# Altium schematic sheet StLink.SchDoc (part 1 of 2)
size A4; SheetNumber: 1; SheetTotal: 1
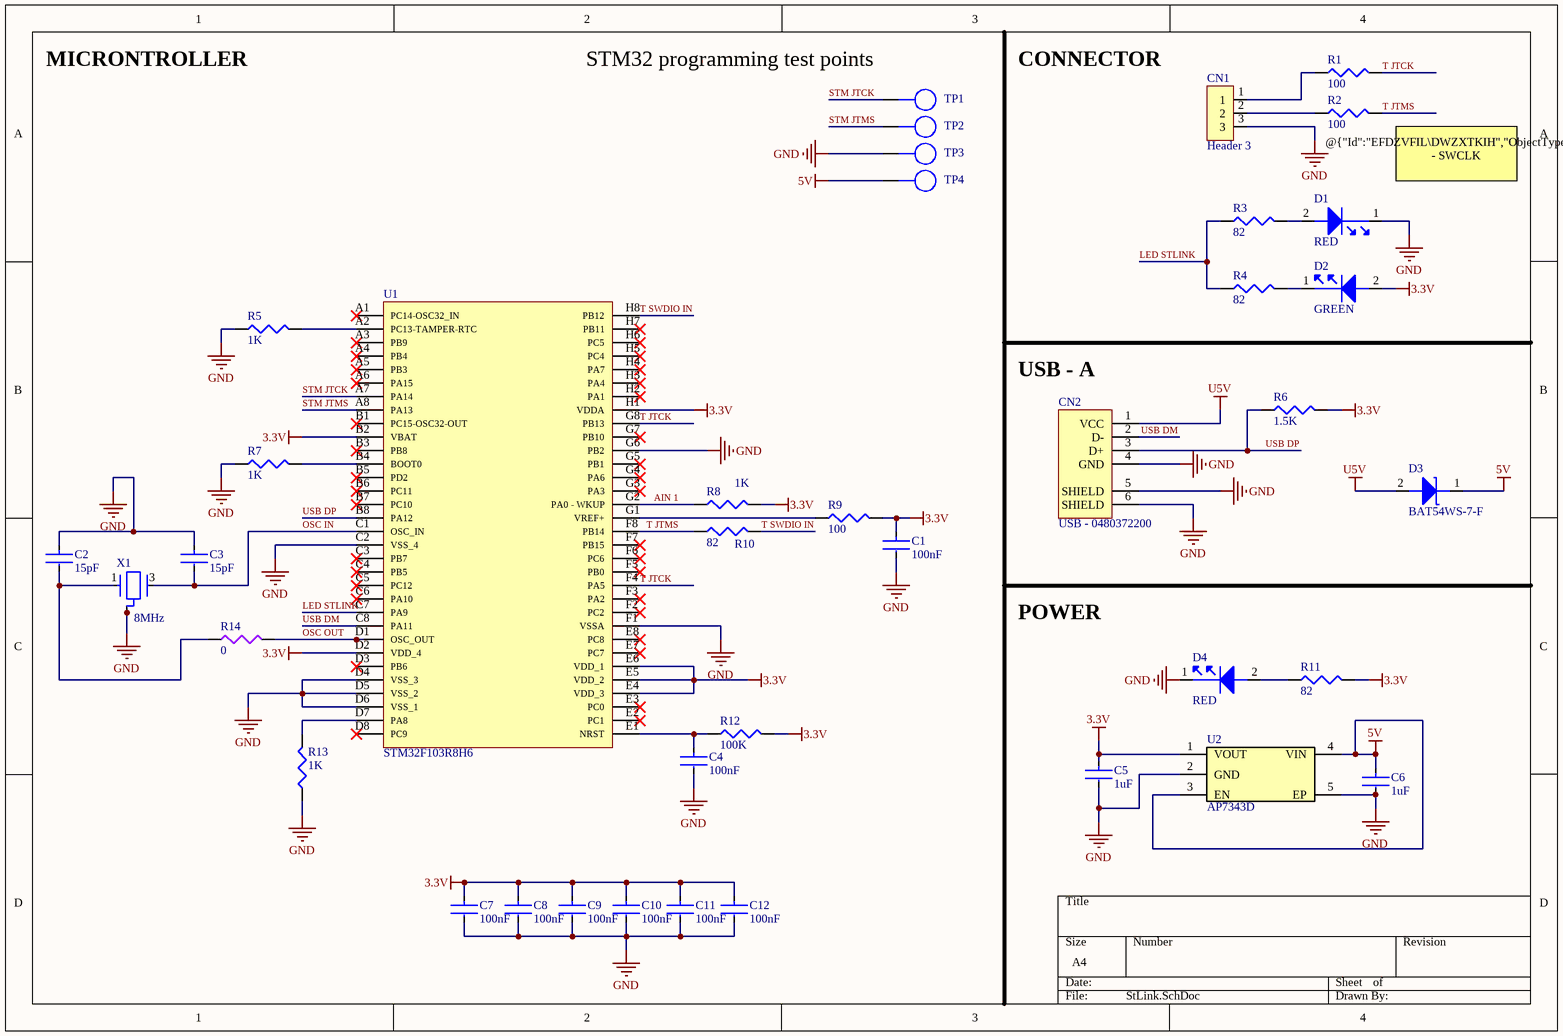
[diagram p0: StLink.SchDoc]

## Parts
C1  100nF  [C0201]
C2  15pF  [C0201]
C3  15pF  [C0201]
C4  100nF  [C0201]
C5  1uF  [C0201]
C6  1uF  [C0201]
C7  100nF  [C0201]
C8  100nF  [C0201]
C9  100nF  [C0201]
C10  100nF  [C0201]
C11  100nF  [C0201]
C12  100nF  [C0201]
CN1  Header 3  [H3x1]
CN2  USB - 0480372200  [usb A]
D1  RED  [Led 0402]
D2  GREEN  [Led 0402]
D3  BAT54WS-7-F  [SOD323]
D4  RED  [Led 0402]
R1  100  [R0201]
R2  100  [R0201]
R3  82  [R0201]
R4  82  [R0201]
R5  1K  [R0201]
R6  1.5K  [R0201]
R7  1K  [R0201]
R8  1K  [R0201]
R9  100  [R0201]
R10  82  [R0201]
R11  82  [R0201]
R12  100K  [R0201]
R13  1K  [R0201]
R14  0  [R0201]
TP1  Test_Point  [PAD]  (value not drawn)
TP2  Test_Point  [PAD]  (value not drawn)
TP3  Test_Point  [PAD]  (value not drawn)
TP4  Test_Point  [PAD]  (value not drawn)
U1  STM32F103R8H6  [Micro BGA]
U2  AP7343D  [AP7343D]
X1  8MHz  [Cristal ECS]

## Nets
3.3V: C1.1 C5.1 C7.1 C8.1 C9.1 C10.1 C11.1 C12.1 D2.2 R6.2 R8.2 R9.2 R11.2 R12.2 U1.B2(VBAT) U1.D2(VDD_4) U1.E4(VDD_3) U1.E5(VDD_2) U1.E6(VDD_1) U1.H1(VDDA) U2.1(VOUT)
5V: C6.1 D3.1 TP4.1 U2.3(EN) U2.4(VIN)
GND: C1.2 C2.1 C3.1 C4.2 C5.2 C6.2 C7.2 C8.2 C9.2 C10.2 C11.2 C12.2 CN1.3 CN2.4(GND) CN2.5(SHIELD) CN2.6(SHIELD) D1.1 D4.1 R5.1 R7.1 R13.1 TP3.1 U1.C2(VSS_4) U1.D4(VSS_3) U1.D5(VSS_2) U1.D6(VSS_1) U1.F1(VSSA) U1.G6(PB2) U2.2(GND) U2.5(EP) X1.2(GND) X1.4(GND)
U5V: CN2.1(VCC) D3.2
AIN 1: R8.1 U1.G2(PA0_-_WKUP)
LED STLINK: R3.1 R4.1 U1.C7(PA9)
OSC IN: C3.2 U1.C1(OSC_IN) X1.3
OSC OUT: R14.2 U1.D1(OSC_OUT)
STM JTCK: TP1.1 U1.A7(PA14)
STM JTMS: TP2.1 U1.A8(PA13)
T JTCK: R1.2 U1.F4(PA5) U1.G8(PB13)
T JTMS: R2.2 R10.1 U1.F8(PB14)
T SWDIO IN: R10.2 U1.H8(PB12)
USB DM: CN2.2(D-) U1.C8(PA11)
USB DP: CN2.3(D+) R6.1 U1.B8(PA12)
NetC2_2: C2.2 R14.1 X1.1
NetC4_1: C4.1 R12.1 U1.E1(NRST)
NetCN1_1: CN1.1 R1.1
NetCN1_2: CN1.2 R2.1
NetD1_2: D1.2 R3.2
NetD2_1: D2.1 R4.2
NetD4_2: D4.2 R11.1
NetR5_2: R5.2 U1.A2(PC13-TAMPER-RTC)
NetR7_2: R7.2 U1.B4(BOOT0)
NetR9_1: R9.1 U1.G1(VREF+)
NetR13_2: R13.2 U1.D7(PA8)

Not connected (* = marked no-connect by the designer): U1 A1(PC14-OSC32_IN)* A3(PB9)* A4(PB4)* A5(PB3)* A6(PA15)* B1(PC15-OSC32-OUT)* B3(PB8)* B5(PD2)* B6(PC11)* B7(PC10)* C3(PB7)* C4(PB5)* C5(PC12)* C6(PA10)* D3(PB6)* D8(PC9)* E2(PC1)* E3(PC0)* E7(PC7)* E8(PC8)* F2(PC2)* F3(PA2)* F5(PB0)* F6(PC6)* F7(PB15)* G3(PA3)* G4(PA6)* G5(PB1)* G7(PB10)* H2(PA1)* H3(PA4)* H4(PA7)* H5(PC4)* H6(PC5)* H7(PB11)*

## Notes on the sheet
- MICRONTROLLER
- (near TP1) STM32 programming test points
- CONNECTOR
- @{"Id":"EFDZVFIL\DWZXTKIH","ObjectType":1} - SWCLK
  @{"Id":"EFDZVFIL\YMTXBQSK","ObjectType":1} - SWDIO
- (near CN2) USB - A
- POWER
## Library data of the parts
C1 C4 C7-C12 = GRM033R60J104KE19D: 6.3V 100nF X5R ±10% 0201 Multilayer Ceramic Capacitors MLCC - SMD/SMT ROHS; Manufacturer: Murata; Manufacturer Lifecycle Status: IN PRODUCTION; Supplier: DigiKey; Supplier Part Number: 490-3167-6-ND; Manufacturer Part Number: GRM033R60J104KE19D; RoHS: Compliant; Category: Ceramic Capacitors; Stock: 19959733; Pricing: 1=0,1, 10=0,013, 50=0,0084, 100=0,007, 500=0,00476, 1000=0,00409, 2500=0,00338, 5000=0,00295 (USD); Value: 100nF; Case/Package: 0201; Case Code (Imperial): 0201; Case Code (Metric): 0603; Country of Origin: Philippines; Depth: 300µm; Dielectric: X5R; Dielectric Material: Ceramic; Export Control Classification Number (ECCN) Code: EAR99; Height: 300µm; Harmonized Tariff Schedule (HTS) Code: 8532.24.00.20; Introduction Date: 2004-09-04; Lead Free: Lead Free; Length: 600µm; Lifecycle Status: Production; Material: Ceramic; Max Operating Temperature: 85°C; Min Operating Temperature: -55°C; Mounting Technology: Surface Mount; Pins: 2; Number of Terminals: 2; Packaging: Cut Tape (CT); Radiation Hardening: No; REACH SVHC: Yes; Schedule B: 8532240020, 8532240020|8532240020, 8532240020|8532240020|8532240020, 8532240020|8532240020|8532240020|8532240020; Termination: SMD/SMT; Thickness: 300µm; Tolerance: 10%; Voltage: 6.3V; Voltage Rating: 6.3V; Voltage Rating (DC): 6.3V; Weight: 170.097139µg; Width: 300µm; ComponentLink1URL: https://datasheet.octopart.com:443/GRM033R60J104KE19D-Murata-datasheet-5390194.pdf?src-supplier=Upverter; ComponentLink1Description: https://datasheet.octopart.com:443/GRM033R60J104KE19D-Murata-datasheet-5390194.pdf?src-supplier=Upverter; ComponentLink2URL: https://datasheet.octopart.com:443/GRM033R60J104KE19D-Murata-datasheet-62317028.pdf?src-supplier=element14+APAC; ComponentLink2Description: https://datasheet.octopart.com:443/GRM033R60J104KE19D-Murata-datasheet-62317028.pdf?src-supplier=element14+APAC; ComponentLink3URL: https://datasheet.octopart.com:443/GRM033R60J104KE19D-Murata-datasheet-17853058.pdf?src-supplier=element14+APAC; ComponentLink3Description: https://datasheet.octopart.com:443/GRM033R60J104KE19D-Murata-datasheet-17853058.pdf?src-supplier=element14+APAC; ComponentLink4URL: https://datasheet.octopart.com:443/GRM033R60J104KE19D-Murata-datasheet-8397485.pdf?src-supplier=Newark; ComponentLink4Description: https://datasheet.octopart.com:443/GRM033R60J104KE19D-Murata-datasheet-8397485.pdf?src-supplier=Newark; ComponentLink5URL: https://datasheet.octopart.com:443/GRM033R60J104KE19D-Murata-datasheet-14399027.pdf?src-supplier=Future+Electronics; ComponentLink5Description: https://datasheet.octopart.com:443/GRM033R60J104KE19D-Murata-datasheet-14399027.pdf?src-supplier=Future+Electronics; ComponentLink6URL: https://datasheet.octopart.com:443/GRM033R60J104KE19D-Murata-datasheet-22122223.pdf?src-supplier=Future+Electronics; ComponentLink6Description: https://datasheet.octopart.com:443/GRM033R60J104KE19D-Murata-datasheet-22122223.pdf?src-supplier=Future+Electronics; ComponentLink7URL: https://datasheet.octopart.com:443/GRM033R60J104KE19D-Murata-datasheet-44105374.pdf?src-supplier=Future+Electronics; ComponentLink7Description: https://datasheet.octopart.com:443/GRM033R60J104KE19D-Murata-datasheet-44105374.pdf?src-supplier=Future+Electronics; ComponentLink8URL: https://datasheet.octopart.com:443/GRM033R60J104KE19D-Murata-datasheet-165579666.pdf?src-supplier=TME; ComponentLink8Description: https://datasheet.octopart.com:443/GRM033R60J104KE19D-Murata-datasheet-165579666.pdf?src-supplier=TME; ComponentLink9URL: https://datasheet.octopart.com:443/GRM033R60J104KE19D-Murata-datasheet-140710156.pdf?src-supplier=TME; ComponentLink9Description: https://datasheet.octopart.com:443/GRM033R60J104KE19D-Murata-datasheet-140710156.pdf?src-supplier=TME; ComponentLink10URL: https://datasheet.octopart.com:443/GRM033R60J104KE19D-Murata-datasheet-141274201.pdf?src-supplier=Ciiva; ComponentLink10Description: https://datasheet.octopart.com:443/GRM033R60J104KE19D-Murata-datasheet-141274201.pdf?src-supplier=Ciiva; ComponentLink11URL: https://datasheet.octopart.com:443/GRM033R60J104KE19D-Murata-datasheet-140675741.pdf?src-supplier=Ciiva; ComponentLink11Description: https://datasheet.octopart.com:443/GRM033R60J104KE19D-Murata-datasheet-140675741.pdf?src-supplier=Ciiva; ComponentLink12URL: https://datasheet.octopart.com:443/GRM033R60J104KE19D-Murata-datasheet-138738333.pdf?src-supplier=Ciiva; ComponentLink12Description: https://datasheet.octopart.com:443/GRM033R60J104KE19D-Murata-datasheet-138738333.pdf?src-supplier=Ciiva; ComponentLink13URL: https://datasheet.octopart.com/GRM033R60J104KE19D-Murata-datasheet-12515295.pdf; ComponentLink13Description: https://datasheet.octopart.com/GRM033R60J104KE19D-Murata-datasheet-12515295.pdf; ComponentLink14URL: https://datasheet.octopart.com/GRM033R60J104KE19D-Murata-datasheet-12510076.pdf; ComponentLink14Description: https://datasheet.octopart.com/GRM033R60J104KE19D-Murata-datasheet-12510076.pdf; ComponentLink15URL: https://datasheet.octopart.com/GRM033R60J104KE19D-Murata-datasheet-11978611.pdf; ComponentLink15Description: https://datasheet.octopart.com/GRM033R60J104KE19D-Murata-datasheet-11978611.pdf; ComponentLink16URL: https://datasheet.octopart.com/GRM033R60J104KE19D-Murata-datasheet-10025737.pdf; ComponentLink16Description: https://datasheet.octopart.com/GRM033R60J104KE19D-Murata-datasheet-10025737.pdf; ComponentLink17URL: https://datasheet.octopart.com/GRM033R60J104KE19D-Murata-datasheet-8819587.pdf; ComponentLink17Description: https://datasheet.octopart.com/GRM033R60J104KE19D-Murata-datasheet-8819587.pdf; ComponentLink18URL: https://datasheet.octopart.com:443/GRM033R60J104KE19D-Murata-datasheet-12510170.pdf?src-supplier=Factory+Futures; ComponentLink18Description: https://datasheet.octopart.com:443/GRM033R60J104KE19D-Murata-datasheet-12510170.pdf?src-supplier=Factory+Futures; ComponentLink19URL: https://datasheet.octopart.com:443/GRM033R60J104KE19D-Murata-datasheet-8517407.pdf?src-supplier=Factory+Futures; ComponentLink19Description: https://datasheet.octopart.com:443/GRM033R60J104KE19D-Murata-datasheet-8517407.pdf?src-supplier=Factory+Futures; ComponentLink20URL: https://datasheet.octopart.com:443/GRM033R60J104KE19D-Murata-datasheet-8387045.pdf?src-supplier=Factory+Futures; ComponentLink20Description: https://datasheet.octopart.com:443/GRM033R60J104KE19D-Murata-datasheet-8387045.pdf?src-supplier=Factory+Futures; ComponentLink21URL: https://datasheet.octopart.com:443/GRM033R60J104KE19D-Murata-datasheet-8324201.pdf?src-supplier=Factory+Futures; ComponentLink21Description: https://datasheet.octopart.com:443/GRM033R60J104KE19D-Murata-datasheet-8324201.pdf?src-supplier=Factory+Futures; ComponentLink22URL: https://datasheet.octopart.com:443/GRM033R60J104KE19D-Murata-datasheet-7628724.pdf?src-supplier=Factory+Futures; ComponentLink22Description: https://datasheet.octopart.com:443/GRM033R60J104KE19D-Murata-datasheet-7628724.pdf?src-supplier=Factory+Futures; ComponentLink23URL: https://datasheet.octopart.com:443/GRM033R60J104KE19D-Murata-datasheet-552801.pdf?src-supplier=Factory+Futures; ComponentLink23Description: https://datasheet.octopart.com:443/GRM033R60J104KE19D-Murata-datasheet-552801.pdf?src-supplier=Factory+Futures; ComponentLink24URL: https://datasheet.octopart.com:443/GRM033R60J104KE19D.-Murata-datasheet-5332913.pdf?src-supplier=Farnell; ComponentLink24Description: https://datasheet.octopart.com:443/GRM033R60J104KE19D.-Murata-datasheet-5332913.pdf?src-supplier=Farnell; ComponentLink25URL: https://datasheet.octopart.com:443/GRM033R60J104KE19D-Murata-datasheet-148210.pdf?src-supplier=Garrett; ComponentLink25Description: https://datasheet.octopart.com:443/GRM033R60J104KE19D-Murata-datasheet-148210.pdf?src-supplier=Garrett; ComponentLink26URL: https://datasheet.octopart.com:443/GRM033R60J104KE19D-Murata-datasheet-118811.pdf?src-supplier=DigiKey; ComponentLink26Description: https://datasheet.octopart.com:443/GRM033R60J104KE19D-Murata-datasheet-118811.pdf?src-supplier=DigiKey; ComponentLink27URL: http://sigma.octopart.com:80/reach_statement/Murata-company-16.pdf?src-supplier=Compliance+Statements; ComponentLink27Description: http://sigma.octopart.com:80/reach_statement/Murata-company-16.pdf?src-supplier=Compliance+Statements; Supplier 1: DigiKey; Supplier Part Number 1: 490-3167-6-ND
C2 C3 = GRM0335C1E150JA01D: 25V 15pF C0G ±5% 0201 Multilayer Ceramic Capacitors MLCC - SMD/SMT ROHS; Manufacturer: Murata; Manufacturer Lifecycle Status: IN PRODUCTION; Temperature Coefficient: 30ppm/°C; Supplier: DigiKey; Supplier Part Number: 490-9658-1-ND; Manufacturer Part Number: GRM0335C1E150JA01D; RoHS: Compliant; Category: Ceramic Capacitors; Stock: 436682; Pricing: 1=0,1, 10=0,014, 50=0,009, 100=0,0076, 500=0,00518, 1000=0,00446, 2500=0,00369, 5000=0,00323 (USD); Value: 15pF; Case/Package: 0201; Case Code (Imperial): 0201; Case Code (Metric): 0603; Depth: 300µm; Dielectric: C0G; Dielectric Material: Ceramic; Height: 300µm; Lead Free: Lead Free; Length: 600µm; Lifecycle Status: Production; Material: Ceramic; Max Operating Temperature: 125°C; Min Operating Temperature: -55°C; Mounting Technology: Surface Mount; Number of Terminals: 2; Packaging: Cut Tape; Radiation Hardening: No; REACH SVHC: Yes; Schedule B: 8532240020, 8532240020|8532240020, 8532240020|8532240020|8532240020, 8532240020|8532240020|8532240020|8532240020; Termination: SMD/SMT; Thickness: 300µm; Tolerance: 5%; Voltage Rating: 25V; Voltage Rating (DC): 25V; Width: 300µm; ComponentLink1URL: https://datasheet.octopart.com:443/GRM0335C1E150JA01D-Murata-datasheet-62317006.pdf?src-supplier=element14+APAC; ComponentLink1Description: https://datasheet.octopart.com:443/GRM0335C1E150JA01D-Murata-datasheet-62317006.pdf?src-supplier=element14+APAC; ComponentLink2URL: https://datasheet.octopart.com:443/GRM0335C1E150JA01D-Murata-datasheet-12532738.pdf?src-supplier=HQonline; ComponentLink2Description: https://datasheet.octopart.com:443/GRM0335C1E150JA01D-Murata-datasheet-12532738.pdf?src-supplier=HQonline; ComponentLink3URL: https://datasheet.octopart.com:443/GRM0335C1E150JA01D-Murata-datasheet-165579666.pdf?src-supplier=TME; ComponentLink3Description: https://datasheet.octopart.com:443/GRM0335C1E150JA01D-Murata-datasheet-165579666.pdf?src-supplier=TME; ComponentLink4URL: https://datasheet.octopart.com:443/GRM0335C1E150JA01D-Murata-datasheet-141273935.pdf?src-supplier=Ciiva; ComponentLink4Description: https://datasheet.octopart.com:443/GRM0335C1E150JA01D-Murata-datasheet-141273935.pdf?src-supplier=Ciiva; ComponentLink5URL: https://datasheet.octopart.com:443/GRM0335C1E150JA01D-Murata-datasheet-140673894.pdf?src-supplier=Ciiva; ComponentLink5Description: https://datasheet.octopart.com:443/GRM0335C1E150JA01D-Murata-datasheet-140673894.pdf?src-supplier=Ciiva; ComponentLink6URL: https://datasheet.octopart.com:443/GRM0335C1E150JA01D-Murata-datasheet-138736674.pdf?src-supplier=Ciiva; ComponentLink6Description: https://datasheet.octopart.com:443/GRM0335C1E150JA01D-Murata-datasheet-138736674.pdf?src-supplier=Ciiva; ComponentLink7URL: https://datasheet.octopart.com:443/GRM0335C1E150JA01D-Murata-datasheet-22122223.pdf?src-supplier=Future+Electronics; ComponentLink7Description: https://datasheet.octopart.com:443/GRM0335C1E150JA01D-Murata-datasheet-22122223.pdf?src-supplier=Future+Electronics; ComponentLink8URL: https://datasheet.octopart.com/GRM0335C1E150JA01D-Murata-datasheet-12515295.pdf; ComponentLink8Description: https://datasheet.octopart.com/GRM0335C1E150JA01D-Murata-datasheet-12515295.pdf; ComponentLink9URL: https://datasheet.octopart.com/GRM0335C1E150JA01D-Murata-datasheet-12510076.pdf; ComponentLink9Description: https://datasheet.octopart.com/GRM0335C1E150JA01D-Murata-datasheet-12510076.pdf; ComponentLink10URL: https://datasheet.octopart.com/GRM0335C1E150JA01D-Murata-datasheet-11978611.pdf; ComponentLink10Description: https://datasheet.octopart.com/GRM0335C1E150JA01D-Murata-datasheet-11978611.pdf; ComponentLink11URL: https://datasheet.octopart.com/GRM0335C1E150JA01D-Murata-datasheet-10025737.pdf; ComponentLink11Description: https://datasheet.octopart.com/GRM0335C1E150JA01D-Murata-datasheet-10025737.pdf; ComponentLink12URL: https://datasheet.octopart.com/GRM0335C1E150JA01D-Murata-datasheet-8819587.pdf; ComponentLink12Description: https://datasheet.octopart.com/GRM0335C1E150JA01D-Murata-datasheet-8819587.pdf; ComponentLink13URL: https://datasheet.octopart.com/GRM0335C1E150JA01D-Murata-datasheet-14397959.pdf; ComponentLink13Description: https://datasheet.octopart.com/GRM0335C1E150JA01D-Murata-datasheet-14397959.pdf; ComponentLink14URL: http://sigma.octopart.com:80/reach_statement/Murata-company-16.pdf?src-supplier=Compliance+Statements; ComponentLink14Description: http://sigma.octopart.com:80/reach_statement/Murata-company-16.pdf?src-supplier=Compliance+Statements; Supplier 1: DigiKey; Supplier Part Number 1: 490-9658-1-ND
C5 C6 = GRM033R61C105ME15D: 16V 1uF X5R ±20% 0201 Multilayer Ceramic Capacitors MLCC - SMD/SMT ROHS; Manufacturer: Murata; Manufacturer Lifecycle Status: IN PRODUCTION; Value: 1µF; Supplier: DigiKey; Supplier Part Number: 490-18654-1-ND; Manufacturer Part Number: GRM033R61C105ME15D; RoHS: Compliant; Category: Ceramic Capacitors; Stock: 494203; Pricing: 1=0,14, 10=0,078, 50=0,0542, 100=0,0471, 500=0,03512, 1000=0,03144, 2500=0,02756, 5000=0,02522 (USD); Case/Package: 0201; Country of Origin: Japan, Mainland China, Philippines, Singapore, Thailand; Dielectric: X5R; Dielectric Material: Ceramic; Export Control Classification Number (ECCN) Code: EAR99; Height: 300µm; Harmonized Tariff Schedule (HTS) Code: 8532.24.00.20; Introduction Date: 2021-04-22; Length: 600µm; Lifecycle Status: Production; Material: Ceramic; Max Operating Temperature: 85°C; Min Operating Temperature: -55°C; Mounting Technology: Surface Mount; Number of Terminals: 2; REACH SVHC: Yes; Thickness: 300µm; Tolerance: 20%; Voltage Rating: 16V; Voltage Rating (DC): 16V; Width: 300µm; ComponentLink1URL: https://datasheet.octopart.com:443/GRM033R61C105ME15D-Murata-datasheet-155345049.pdf?src-supplier=Newark; ComponentLink1Description: https://datasheet.octopart.com:443/GRM033R61C105ME15D-Murata-datasheet-155345049.pdf?src-supplier=Newark; ComponentLink2URL: https://datasheet.octopart.com:443/GRM033R61C105ME15D-Murata-datasheet-165579666.pdf?src-supplier=TME; ComponentLink2Description: https://datasheet.octopart.com:443/GRM033R61C105ME15D-Murata-datasheet-165579666.pdf?src-supplier=TME; ComponentLink3URL: https://datasheet.octopart.com:443/GRM033R61C105ME15D-Murata-datasheet-141274201.pdf?src-supplier=Ciiva; ComponentLink3Description: https://datasheet.octopart.com:443/GRM033R61C105ME15D-Murata-datasheet-141274201.pdf?src-supplier=Ciiva; ComponentLink4URL: https://datasheet.octopart.com:443/GRM033R61C105ME15D-Murata-datasheet-140676397.pdf?src-supplier=Ciiva; ComponentLink4Description: https://datasheet.octopart.com:443/GRM033R61C105ME15D-Murata-datasheet-140676397.pdf?src-supplier=Ciiva; ComponentLink5URL: https://datasheet.octopart.com:443/GRM033R61C105ME15D-Murata-datasheet-138738456.pdf?src-supplier=Ciiva; ComponentLink5Description: https://datasheet.octopart.com:443/GRM033R61C105ME15D-Murata-datasheet-138738456.pdf?src-supplier=Ciiva; ComponentLink6URL: https://datasheet.octopart.com/GRM033R61C105ME15D-Murata-datasheet-12515295.pdf; ComponentLink6Description: https://datasheet.octopart.com/GRM033R61C105ME15D-Murata-datasheet-12515295.pdf; ComponentLink7URL: https://datasheet.octopart.com/GRM033R61C105ME15D-Murata-datasheet-12510076.pdf; ComponentLink7Description: https://datasheet.octopart.com/GRM033R61C105ME15D-Murata-datasheet-12510076.pdf; ComponentLink8URL: https://datasheet.octopart.com/GRM033R61C105ME15D-Murata-datasheet-11978611.pdf; ComponentLink8Description: https://datasheet.octopart.com/GRM033R61C105ME15D-Murata-datasheet-11978611.pdf; ComponentLink9URL: https://datasheet.octopart.com/GRM033R61C105ME15D-Murata-datasheet-10025737.pdf; ComponentLink9Description: https://datasheet.octopart.com/GRM033R61C105ME15D-Murata-datasheet-10025737.pdf; ComponentLink10URL: https://datasheet.octopart.com/GRM033R61C105ME15D-Murata-datasheet-8819587.pdf; ComponentLink10Description: https://datasheet.octopart.com/GRM033R61C105ME15D-Murata-datasheet-8819587.pdf; ComponentLink11URL: http://sigma.octopart.com:80/reach_statement/Murata-company-16.pdf?src-supplier=Compliance+Statements; ComponentLink11Description: http://sigma.octopart.com:80/reach_statement/Murata-company-16.pdf?src-supplier=Compliance+Statements; Supplier 1: DigiKey; Supplier Part Number 1: 490-18654-1-ND
CN1 = T1M-03-F-SH-L: Conn Shrouded Header (4 Sides) HDR 3 POS 1mm Solder RA Side Entry SMD Micro Mate™ Bulk; Manufacturer: Samtec; Manufacturer Lifecycle Status: PRODUCTION; Supplier: DigiKey; Supplier Part Number: 612-T1M-03-F-SH-LCT-ND; Manufacturer Part Number: T1M-03-F-SH-L; Category: Headers and Wire Housings; Stock: 680; Pricing: 1=2,07, 10=1,76, 25=1,6492, 50=1,5704, 100=1,4953, 250=1,40164 (USD); Color: Natural; Lifecycle Status: Production; Pins: 3; Orientation: Vertical; ComponentLink1URL: https://datasheet.octopart.com:443/T1M-03-F-SH-L-Samtec-datasheet-97293726.pdf?src-supplier=Samtec; ComponentLink1Description: https://datasheet.octopart.com:443/T1M-03-F-SH-L-Samtec-datasheet-97293726.pdf?src-supplier=Samtec; ComponentLink2URL: https://sigma.octopart.com:443/97293727/technical_drawing/Samtec-T1M-03-F-SH-L.pdf?src-supplier=Samtec; ComponentLink2Description: https://sigma.octopart.com:443/97293727/technical_drawing/Samtec-T1M-03-F-SH-L.pdf?src-supplier=Samtec; ComponentLink3URL: https://datasheet.octopart.com:443/T1M-03-F-SH-L-Samtec-datasheet-129018845.pdf?src-supplier=element14+APAC; ComponentLink3Description: https://datasheet.octopart.com:443/T1M-03-F-SH-L-Samtec-datasheet-129018845.pdf?src-supplier=element14+APAC; ComponentLink4URL: https://datasheet.octopart.com:443/T1M-03-F-SH-L-Samtec-datasheet-148850559.pdf?src-supplier=Toby+Electronics; ComponentLink4Description: https://datasheet.octopart.com:443/T1M-03-F-SH-L-Samtec-datasheet-148850559.pdf?src-supplier=Toby+Electronics; ComponentLink5URL: https://datasheet.octopart.com:443/T1M-03-F-SH-L-Samtec-datasheet-116535276.pdf?src-supplier=Toby+Electronics; ComponentLink5Description: https://datasheet.octopart.com:443/T1M-03-F-SH-L-Samtec-datasheet-116535276.pdf?src-supplier=Toby+Electronics; ComponentLink6URL: https://datasheet.octopart.com:443/T1M-03-F-SH-L-Samtec-datasheet-136395486.pdf?src-supplier=Toby+Electronics; ComponentLink6Description: https://datasheet.octopart.com:443/T1M-03-F-SH-L-Samtec-datasheet-136395486.pdf?src-supplier=Toby+Electronics; ComponentLink7URL: https://datasheet.octopart.com:443/T1M-03-F-SH-L-Samtec-datasheet-86810868.pdf?src-supplier=Sager+Electronics; ComponentLink7Description: https://datasheet.octopart.com:443/T1M-03-F-SH-L-Samtec-datasheet-86810868.pdf?src-supplier=Sager+Electronics; Supplier 1: DigiKey; Supplier Part Number 1: 612-T1M-03-F-SH-LCT-ND
CN2 = 48037-2200: USB Connector, 4 Contact(s), Male, Right Angle, Surface Mount Terminal, Locking, Plug; Manufacturer: Molex; Manufacturer Lifecycle Status: ACTIVE; Connector Type: Plug, USB; Current Rating: 1.5A; Insulation Resistance: 1GΩ; Max Voltage Rating (AC): 150V; Number of Circuits: 4; Number of Ports: 1; Pitch: 2mm; Plating: Tin; Plating Thickness: 762nm; USB Standard: USB 2.0; Supplier: DigiKey; Supplier Part Number: WM3983DKR-ND; Manufacturer Part Number: 48037-2200; RoHS: Compliant; Category: USB Connectors; Stock: 10090; Pricing: 1=1,32, 10=1,123, 25=1,0524, 50=1,0022, 100=0,9543 (USD); China RoHS: Compliant; Color: Black; Contact Material: Brass; Contact Plating: Gold; Country of Origin: HK; Export Control Classification Number (ECCN) Code: EAR99; Gender: Male; Halogen Free: Low Halogen; Height: 4.6mm; Housing Material: Nylon; Harmonized Tariff Schedule (HTS) Code: 8536.69.40.30; Introduction Date: 2007-05-29; Lifecycle Status: Production; LTB Date: 2014-09-01; LTD Date: 2014-12-31; Max Operating Temperature: 85°C; Min Operating Temperature: -20°C; Mounting Technology: Surface Mount; Number of Contacts: 4; Pins: 4; Number of Positions: 4; Number of Rows: 1; Number of Terminals: 4; Orientation: Right Angle; Packaging: Cut Tape; Radiation Hardening: No; REACH SVHC: Yes; Schedule B: 8536695050, 8536695050|8536695050|8536695050|8536695050|8536695050; Shell Finish: Nickel; Shell Material: Steel; Terminal Pitch: 2mm; Termination: Solder; Voltage Rating: 150V; Voltage Rating (AC): 150V; ComponentLink1URL: https://datasheet.octopart.com:443/480372200-Molex-datasheet-142372981.pdf?src-supplier=Upverter; ComponentLink1Description: https://datasheet.octopart.com:443/480372200-Molex-datasheet-142372981.pdf?src-supplier=Upverter; ComponentLink2URL: https://datasheet.octopart.com:443/48037-2200-Molex-datasheet-62059301.pdf?src-supplier=Upverter; ComponentLink2Description: https://datasheet.octopart.com:443/48037-2200-Molex-datasheet-62059301.pdf?src-supplier=Upverter; ComponentLink3URL: https://datasheet.octopart.com:443/480372200-Molex-datasheet-8344610.pdf?src-supplier=HQonline; ComponentLink3Description: https://datasheet.octopart.com:443/480372200-Molex-datasheet-8344610.pdf?src-supplier=HQonline; ComponentLink4URL: https://datasheet.octopart.com:443/48037-2200-Molex-datasheet-13746345.pdf?src-supplier=Sager+Electronics; ComponentLink4Description: https://datasheet.octopart.com:443/48037-2200-Molex-datasheet-13746345.pdf?src-supplier=Sager+Electronics; ComponentLink5URL: https://datasheet.octopart.com:443/48037-2200-Molex-datasheet-193109030.pdf?src-supplier=JRH+Electronics; ComponentLink5Description: https://datasheet.octopart.com:443/48037-2200-Molex-datasheet-193109030.pdf?src-supplier=JRH+Electronics; ComponentLink6URL: https://sigma.octopart.com:443/16400051/technical_drawing/Molex-48037-2200.pdf?src-supplier=Molex; ComponentLink6Description: https://sigma.octopart.com:443/16400051/technical_drawing/Molex-48037-2200.pdf?src-supplier=Molex; ComponentLink7URL: https://datasheet.octopart.com:443/48037-2200-Molex-datasheet-77558076.pdf?src-supplier=Farnell; ComponentLink7Description: https://datasheet.octopart.com:443/48037-2200-Molex-datasheet-77558076.pdf?src-supplier=Farnell; ComponentLink8URL: https://datasheet.octopart.com:443/48037-2200-Molex-datasheet-154752285.pdf?src-supplier=Master+Electronics; ComponentLink8Description: https://datasheet.octopart.com:443/48037-2200-Molex-datasheet-154752285.pdf?src-supplier=Master+Electronics; ComponentLink9URL: https://datasheet.octopart.com:443/48037-2200-Molex-datasheet-66635163.pdf?src-supplier=Newark; ComponentLink9Description: https://datasheet.octopart.com:443/48037-2200-Molex-datasheet-66635163.pdf?src-supplier=Newark; ComponentLink10URL: https://datasheet.octopart.com:443/48037-2200-Molex-datasheet-168216728.pdf?src-supplier=TME; ComponentLink10Description: https://datasheet.octopart.com:443/48037-2200-Molex-datasheet-168216728.pdf?src-supplier=TME; ComponentLink11URL: https://datasheet.octopart.com:443/48037-2200-Molex-datasheet-140185240.pdf?src-supplier=RS+(Formerly+Allied+Electronics); ComponentLink11Description: https://datasheet.octopart.com:443/48037-2200-Molex-datasheet-140185240.pdf?src-supplier=RS+(Formerly+Allied+Electronics); ComponentLink12URL: https://datasheet.octopart.com:443/48037-2200-Molex-datasheet-120151368.pdf?src-supplier=RS+(Formerly+Allied+Electronics); ComponentLink12Description: https://datasheet.octopart.com:443/48037-2200-Molex-datasheet-120151368.pdf?src-supplier=RS+(Formerly+Allied+Electronics); ComponentLink13URL: https://datasheet.octopart.com:443/48037-2200-Molex-datasheet-62104878.pdf?src-supplier=Electro+Sonic; ComponentLink13Description: https://datasheet.octopart.com:443/48037-2200-Molex-datasheet-62104878.pdf?src-supplier=Electro+Sonic; ComponentLink14URL: https://datasheet.octopart.com:443/48037-2200-Molex-datasheet-41578501.pdf?src-supplier=Electro+Sonic; ComponentLink14Description: https://datasheet.octopart.com:443/48037-2200-Molex-datasheet-41578501.pdf?src-supplier=Electro+Sonic; ComponentLink15URL: https://datasheet.octopart.com:443/48037-2200-Molex-datasheet-27085190.pdf?src-supplier=Electro+Sonic; ComponentLink15Description: https://datasheet.octopart.com:443/48037-2200-Molex-datasheet-27085190.pdf?src-supplier=Electro+Sonic; ComponentLink16URL: http://sigma.octopart.com:80/16400050/rohs_statement/Molex-48037-2200.pdf?src-supplier=Compliance+Statements; ComponentLink16Description: http://sigma.octopart.com:80/16400050/rohs_statement/Molex-48037-2200.pdf?src-supplier=Compliance+Statements; ComponentLink17URL: http://sigma.octopart.com:80/reach_statement/Molex-company-74.pdf?src-supplier=Compliance+Statements; ComponentLink17Description: http://sigma.octopart.com:80/reach_statement/Molex-company-74.pdf?src-supplier=Compliance+Statements; ComponentLink18URL: http://sigma.octopart.com:80/rohs_statement/Molex-company-73.pdf?src-supplier=Compliance+Statements; ComponentLink18Description: http://sigma.octopart.com:80/rohs_statement/Molex-company-73.pdf?src-supplier=Compliance+Statements; ComponentLink19URL: http://sigma.octopart.com:80/conflict_mineral_statement/Molex-company-72.pdf?src-supplier=Compliance+Statements; ComponentLink19Description: http://sigma.octopart.com:80/conflict_mineral_statement/Molex-company-72.pdf?src-supplier=Compliance+Statements; Supplier 1: DigiKey; Supplier Part Number 1: WM3983DKR-ND
D1 D4 = 150040RS73240: Wurth Elektronik LED, WL-SMCC, 1005 (0402), 625 nm, 1 x 0.5 x 0.4mm; Manufacturer Lifecycle Status: ACTIVE; Dominant Wavelength: 625nm; Forward Current: 60mA; Forward Voltage: 2V; Luminous Intensity: 100mcd; Max Junction Temperature (Tj): 95°C; Max Reverse Voltage (DC): 5V; Peak Wavelength: 630nm; Power Dissipation: 72mW; Viewing Angle: 120°; YEOL: 1 = Estimated lifetime > 10 years; Supplier: DigiKey; Supplier Part Number: 732-11991-1-ND; Manufacturer: Wurth Elektronik; Manufacturer Part Number: 150040RS73240; RoHS: Compliant; Category: LEDs; Stock: 5288; Pricing: 1=0,32, 10=0,271, 100=0,244, 500=0,217, 1000=0,191 (USD); Case/Package: 0402; Color: Red; Height: 400µm; Length: 1mm; Lifecycle Status: Production; Max Operating Temperature: 85°C; Min Operating Temperature: -40°C; Packaging: Tape and Reel; Reverse Voltage: 5V; Wavelength: 625nm; Width: 500µm; ComponentLink1URL: https://datasheet.octopart.com:443/150040RS73240-W%C3%BCrth-Elektronik-datasheet-140170125.pdf?src-supplier=Wurth+Elektronik; ComponentLink1Description: https://datasheet.octopart.com:443/150040RS73240-W%C3%BCrth-Elektronik-datasheet-140170125.pdf?src-supplier=Wurth+Elektronik; Supplier 1: DigiKey; Supplier Part Number 1: 732-11991-1-ND
D2 = 150040VS73240: Wurth Elektronik LED, WL-SMCC, 1005 (0402), 570 nm, 1 x 0.5 x 0.4mm; Manufacturer Lifecycle Status: ACTIVE; Dominant Wavelength: 570nm; Forward Current: 60mA; Forward Voltage: 2V; Luminous Intensity: 50mcd; Max Junction Temperature (Tj): 95°C; Max Reverse Voltage (DC): 5V; Peak Wavelength: 572nm; Power Dissipation: 75mW; Viewing Angle: 120°; YEOL: 1 = Estimated lifetime > 10 years; Supplier: DigiKey; Supplier Part Number: 732-11992-1-ND; Manufacturer: Wurth Elektronik; Manufacturer Part Number: 150040VS73240; RoHS: Compliant; Category: LEDs; Stock: 80192; Pricing: 1=0,32, 10=0,271, 100=0,244, 500=0,217, 1000=0,191 (USD); Case/Package: 0402; Color: Green; Height: 400µm; Length: 1mm; Lifecycle Status: Production; Max Operating Temperature: 85°C; Min Operating Temperature: -40°C; Packaging: Tape and Reel; Reverse Voltage: 5V; Wavelength: 570nm; Width: 500µm; ComponentLink1URL: https://datasheet.octopart.com:443/150040VS73240-W%C3%BCrth-Elektronik-datasheet-140170126.pdf?src-supplier=Wurth+Elektronik; ComponentLink1Description: https://datasheet.octopart.com:443/150040VS73240-W%C3%BCrth-Elektronik-datasheet-140170126.pdf?src-supplier=Wurth+Elektronik; Supplier 1: DigiKey; Supplier Part Number 1: 732-11992-1-ND
D3 = BAT54WS-7-F: Schottky Diode Sod323 T&r 3K Rohs Compliant: Yes |Diodes Inc. BAT54WS-7-F; Average Rectified Current: 100mA; Value: 10pF; Current Rating: 200mA; Element Configuration: Single; Forward Voltage: 1V; Max Forward Surge Current (Ifsm): 600mA; Max Junction Temperature (Tj): 150°C; Max Power Dissipation: 200mW; Max Repetitive Reverse Voltage (Vrrm): 30V; Number of Elements: 1; Peak Reverse Current: 2µA; Polarity: Standard; Reverse Recovery Time: 5ns; Reverse Standoff Voltage: 25V; Reverse Voltage: 21V; Parameter 1: C124205; Supplier: DigiKey; Supplier Part Number: BAT54WS-FDICT-ND; Manufacturer: Diodes Inc.; Manufacturer Part Number: BAT54WS-7-F; RoHS: Compliant; Category: Schottky Diodes; Stock: 46117; Pricing: 1=0,1, 10=0,064, 100=0,0617, 500=0,04736, 1000=0,04232 (USD); China RoHS: Compliant; Contact Plating: Tin; Country of Origin: Mainland China, Taiwan; Export Control Classification Number (ECCN) Code: EAR99; Forward Current: 200mA; Height: 1.2mm; Harmonized Tariff Schedule (HTS) Code: 8541.10.00.70; Introduction Date: 2002-09-16; Lead Free: Lead Free; Length: 1.8mm; Lifecycle Status: Production; Max Operating Temperature: 150°C; Max Output current: 100mA; Max Reverse Voltage (DC): 30V; Min Breakdown Voltage: 30V; Min Operating Temperature: -65°C; Mounting Technology: Surface Mount; Pins: 2; Number of Terminals: 2; Output Current: 100mA; Packaging: Cut Tape; Peak Non-Repetitive Surge Current: 600mA; Power Dissipation: 200mW; Power Rating: 200mW; Radiation Hardening: No; REACH SVHC: Yes; Schedule B: 8541100070, 8541100070|8541100070|8541100070|8541100070|8541100070; Voltage Rating (DC): 30V; Weight: 4.904468mg; Width: 1.4mm; ComponentLink1URL: https://datasheet.octopart.com:443/BAT54WS-7-F-Diodes-Inc.-datasheet-166296601.pdf?src-supplier=IHS; ComponentLink1Description: https://datasheet.octopart.com:443/BAT54WS-7-F-Diodes-Inc.-datasheet-166296601.pdf?src-supplier=IHS; ComponentLink2URL: https://datasheet.octopart.com:443/BAT54WS-7-F-Diodes-Inc.-datasheet-134530444.pdf?src-supplier=ODG+(Origin+Data+Global); ComponentLink2Description: https://datasheet.octopart.com:443/BAT54WS-7-F-Diodes-Inc.-datasheet-134530444.pdf?src-supplier=ODG+(Origin+Data+Global); ComponentLink3URL: https://sigma.octopart.com:443/138810740/technical_drawing/Diodes-Inc.-BAT54WS-7-F.pdf?src-supplier=Diodes+Inc+SCT; ComponentLink3Description: https://sigma.octopart.com:443/138810740/technical_drawing/Diodes-Inc.-BAT54WS-7-F.pdf?src-supplier=Diodes+Inc+SCT; ComponentLink4URL: https://datasheet.octopart.com:443/BAT54WS-7-F-Diodes-Inc.-datasheet-38879683.pdf?src-supplier=Newark; ComponentLink4Description: https://datasheet.octopart.com:443/BAT54WS-7-F-Diodes-Inc.-datasheet-38879683.pdf?src-supplier=Newark; ComponentLink5URL: https://datasheet.octopart.com:443/BAT54WS-7-F-Diodes-Inc.-datasheet-8330708.pdf?src-supplier=element14+APAC; ComponentLink5Description: https://datasheet.octopart.com:443/BAT54WS-7-F-Diodes-Inc.-datasheet-8330708.pdf?src-supplier=element14+APAC; ComponentLink6URL: https://datasheet.octopart.com:443/BAT54WS-7-F-Diodes-Inc.-datasheet-62304969.pdf?src-supplier=Future+Electronics; ComponentLink6Description: https://datasheet.octopart.com:443/BAT54WS-7-F-Diodes-Inc.-datasheet-62304969.pdf?src-supplier=Future+Electronics; ComponentLink7URL: https://datasheet.octopart.com:443/BAT54WS-7-F-Diodes-Inc.-datasheet-14053335.pdf?src-supplier=iiiC; ComponentLink7Description: https://datasheet.octopart.com:443/BAT54WS-7-F-Diodes-Inc.-datasheet-14053335.pdf?src-supplier=iiiC; ComponentLink8URL: https://datasheet.octopart.com:443/BAT54WS-7-F-Diodes-Inc.-datasheet-8193963.pdf?src-supplier=Jameco; ComponentLink8Description: https://datasheet.octopart.com:443/BAT54WS-7-F-Diodes-Inc.-datasheet-8193963.pdf?src-supplier=Jameco; ComponentLink9URL: https://datasheet.octopart.com:443/BAT54WS-7-F-Diodes-Inc.-datasheet-130944.pdf?src-supplier=DigiKey; ComponentLink9Description: https://datasheet.octopart.com:443/BAT54WS-7-F-Diodes-Inc.-datasheet-130944.pdf?src-supplier=DigiKey; ComponentLink10URL: http://sigma.octopart.com:80/15616894/materials_sheet/Diodes-Inc.-BAT54WS-7-F.pdf?src-supplier=Compliance+Statements; ComponentLink10Description: http://sigma.octopart.com:80/15616894/materials_sheet/Diodes-Inc.-BAT54WS-7-F.pdf?src-supplier=Compliance+Statements; Supplier 1: DigiKey; Supplier Part Number 1: BAT54WS-FDICT-ND; Supplier Location 1: US; Supplier Unit Price 1: $0.10; Supplier Packaging 1: Cut Tape
R1 R2 R9 = RC0201FR-07100RL: 50mW Thick Film Resistors 25V ±1% ±200ppm/℃ 100Ω 0201 Chip Resistor - Surface Mount ROHS; Manufacturer: Yageo Group; Temperature Coefficient: 200ppm/°C; Supplier: DigiKey; Supplier Part Number: 311-100MCT-ND; Manufacturer Part Number: RC0201FR-07100RL; RoHS: Compliant; Category: Chip SMD Resistors; Stock: 481195; Pricing: 1=0,1, 10=0,034, 25=0,0252, 50=0,0204, 100=0,0168, 250=0,01316, 500=0,01112, 1000=0,00952, 5000=0,00698 (USD); Case/Package: 0201; Case Code (Imperial): 0201; Case Code (Metric): 0603; China RoHS: Non-Compliant; Composition: Thick Film; Contact Plating: Tin; Features: Moisture Resistant; Height: 230µm; Lead Free: Lead Free; Length: 600µm; Lifecycle Status: Production; Max Operating Temperature: 125°C; Max Power Dissipation: 50mW; Min Operating Temperature: -55°C; Mounting Technology: Surface Mount; Number of Terminals: 2; Number of Terminations: 2; Power Rating: 50mW; Radiation Hardening: No; REACH SVHC: Yes; Value: 100Ω; Schedule B: 8533210045, 8533210045|8533210045|8533210045|8533210045|8533210045|8533210045|8533210045|8533210045|8533210045|8533210045|8533210045|8533210045|8533210045|8533210045|8533210045|8533210045|8533210045|8533210045|8533210045|8533210045|8533210045|8533210045|8533210045|85; Termination: SMD/SMT; Tolerance: 1%; Voltage Rating: 25V; Width: 300µm; Working Voltage: 25V; ComponentLink1URL: https://datasheet.octopart.com:443/RC0201FR-07100RL-Yageo-datasheet-175887523.pdf?src-supplier=Newark; ComponentLink1Description: https://datasheet.octopart.com:443/RC0201FR-07100RL-Yageo-datasheet-175887523.pdf?src-supplier=Newark; ComponentLink2URL: https://datasheet.octopart.com:443/RC0201FR-07100RL-Yageo-datasheet-10025917.pdf?src-supplier=Newark; ComponentLink2Description: https://datasheet.octopart.com:443/RC0201FR-07100RL-Yageo-datasheet-10025917.pdf?src-supplier=Newark; ComponentLink3URL: https://datasheet.octopart.com:443/RC0201FR-07100RL-Yageo-datasheet-12509713.pdf?src-supplier=_legacy+Avnet; ComponentLink3Description: https://datasheet.octopart.com:443/RC0201FR-07100RL-Yageo-datasheet-12509713.pdf?src-supplier=_legacy+Avnet; ComponentLink4URL: https://datasheet.octopart.com:443/RC0201FR-07100RL-Yageo-datasheet-13314888.pdf?src-supplier=Upverter; ComponentLink4Description: https://datasheet.octopart.com:443/RC0201FR-07100RL-Yageo-datasheet-13314888.pdf?src-supplier=Upverter; ComponentLink5URL: https://datasheet.octopart.com:443/RC0201FR-07100RL-Yageo-datasheet-12549147.pdf?src-supplier=Upverter; ComponentLink5Description: https://datasheet.octopart.com:443/RC0201FR-07100RL-Yageo-datasheet-12549147.pdf?src-supplier=Upverter; ComponentLink6URL: https://datasheet.octopart.com:443/RC0201FR-07100RL-Yageo-datasheet-12509741.pdf?src-supplier=Upverter; ComponentLink6Description: https://datasheet.octopart.com:443/RC0201FR-07100RL-Yageo-datasheet-12509741.pdf?src-supplier=Upverter; ComponentLink7URL: https://datasheet.octopart.com:443/RC0201FR-07100RL-Yageo-datasheet-62067350.pdf?src-supplier=element14+APAC; ComponentLink7Description: https://datasheet.octopart.com:443/RC0201FR-07100RL-Yageo-datasheet-62067350.pdf?src-supplier=element14+APAC; ComponentLink8URL: https://datasheet.octopart.com:443/RC0201FR-07100RL-Yageo-datasheet-10911895.pdf?src-supplier=element14+APAC; ComponentLink8Description: https://datasheet.octopart.com:443/RC0201FR-07100RL-Yageo-datasheet-10911895.pdf?src-supplier=element14+APAC; ComponentLink9URL: https://datasheet.octopart.com:443/RC0201FR-07100RL-Yageo-Group-datasheet-176638170.pdf?src-supplier=Future+Electronics; ComponentLink9Description: https://datasheet.octopart.com:443/RC0201FR-07100RL-Yageo-Group-datasheet-176638170.pdf?src-supplier=Future+Electronics; ComponentLink10URL: https://datasheet.octopart.com:443/RC0201FR-07100RL-Yageo-datasheet-164759695.pdf?src-supplier=Future+Electronics; ComponentLink10Description: https://datasheet.octopart.com:443/RC0201FR-07100RL-Yageo-datasheet-164759695.pdf?src-supplier=Future+Electronics; ComponentLink11URL: https://datasheet.octopart.com:443/RC0201FR-07100RL-Yageo-datasheet-127823281.pdf?src-supplier=Future+Electronics; ComponentLink11Description: https://datasheet.octopart.com:443/RC0201FR-07100RL-Yageo-datasheet-127823281.pdf?src-supplier=Future+Electronics; ComponentLink12URL: https://datasheet.octopart.com:443/RC0201FR-07100RL-Yageo-datasheet-137700087.pdf?src-supplier=Future+Electronics; ComponentLink12Description: https://datasheet.octopart.com:443/RC0201FR-07100RL-Yageo-datasheet-137700087.pdf?src-supplier=Future+Electronics; ComponentLink13URL: https://datasheet.octopart.com:443/RC0201FR-07100RL-Yageo-datasheet-103092701.pdf?src-supplier=Future+Electronics; ComponentLink13Description: https://datasheet.octopart.com:443/RC0201FR-07100RL-Yageo-datasheet-103092701.pdf?src-supplier=Future+Electronics; ComponentLink14URL: https://datasheet.octopart.com:443/RC0201FR-07100RL-Yageo-datasheet-98239111.pdf?src-supplier=Future+Electronics; ComponentLink14Description: https://datasheet.octopart.com:443/RC0201FR-07100RL-Yageo-datasheet-98239111.pdf?src-supplier=Future+Electronics; ComponentLink15URL: https://datasheet.octopart.com:443/RC0201FR-07100RL-Yageo-datasheet-44382975.pdf?src-supplier=Future+Electronics; ComponentLink15Description: https://datasheet.octopart.com:443/RC0201FR-07100RL-Yageo-datasheet-44382975.pdf?src-supplier=Future+Electronics; ComponentLink16URL: https://datasheet.octopart.com:443/RC0201FR-07100RL-Yageo-datasheet-41589693.pdf?src-supplier=Future+Electronics; ComponentLink16Description: https://datasheet.octopart.com:443/RC0201FR-07100RL-Yageo-datasheet-41589693.pdf?src-supplier=Future+Electronics; ComponentLink17URL: https://datasheet.octopart.com:443/RC0201FR-07100RL-Yageo-datasheet-37140709.pdf?src-supplier=Future+Electronics; ComponentLink17Description: https://datasheet.octopart.com:443/RC0201FR-07100RL-Yageo-datasheet-37140709.pdf?src-supplier=Future+Electronics; ComponentLink18URL: https://datasheet.octopart.com:443/RC0201FR-07100RL-Yageo-datasheet-12509768.pdf?src-supplier=Future+Electronics; ComponentLink18Description: https://datasheet.octopart.com:443/RC0201FR-07100RL-Yageo-datasheet-12509768.pdf?src-supplier=Future+Electronics; ComponentLink19URL: https://datasheet.octopart.com:443/RC0201FR-07100RL-Yageo-datasheet-12590898.pdf?src-supplier=Future+Electronics; ComponentLink19Description: https://datasheet.octopart.com:443/RC0201FR-07100RL-Yageo-datasheet-12590898.pdf?src-supplier=Future+Electronics; ComponentLink20URL: https://datasheet.octopart.com:443/RC0201FR-07100RL-Yageo-datasheet-8325180.pdf?src-supplier=Future+Electronics; ComponentLink20Description: https://datasheet.octopart.com:443/RC0201FR-07100RL-Yageo-datasheet-8325180.pdf?src-supplier=Future+Electronics; ComponentLink21URL: https://datasheet.octopart.com:443/RC0201FR-07100RL-Yageo-datasheet-12535854.pdf?src-supplier=Future+Electronics; ComponentLink21Description: https://datasheet.octopart.com:443/RC0201FR-07100RL-Yageo-datasheet-12535854.pdf?src-supplier=Future+Electronics; ComponentLink22URL: https://datasheet.octopart.com:443/RC0201FR-07100RL-Yageo-datasheet-148775077.pdf?src-supplier=TME; ComponentLink22Description: https://datasheet.octopart.com:443/RC0201FR-07100RL-Yageo-datasheet-148775077.pdf?src-supplier=TME; ComponentLink23URL: https://datasheet.octopart.com/RC0201FR-07100RL-Yageo-datasheet-73766026.pdf; ComponentLink23Description: https://datasheet.octopart.com/RC0201FR-07100RL-Yageo-datasheet-73766026.pdf; ComponentLink24URL: http://sigma.octopart.com:80/conflict_mineral_statement/Yageo-company-3.pdf?src-supplier=Compliance+Statements; ComponentLink24Description: http://sigma.octopart.com:80/conflict_mineral_statement/Yageo-company-3.pdf?src-supplier=Compliance+Statements; ComponentLink25URL: http://sigma.octopart.com:80/rohs_statement/Yageo-company-2.pdf?src-supplier=Compliance+Statements; ComponentLink25Description: http://sigma.octopart.com:80/rohs_statement/Yageo-company-2.pdf?src-supplier=Compliance+Statements; Supplier 1: DigiKey; Supplier Part Number 1: 311-100MCT-ND
R3 R4 R10 R11 = RC0201JR-0782RL: Res Thick Film 0201 82 Ohm 5% 0.05W(1/20W) ±200ppm/C Pad SMD T/R; Manufacturer: Yageo Group; Max Power Dissipation: 50mW; Value: 82Ω; Temperature Coefficient: 200ppm/°C; Voltage Rating: 25V; Supplier: DigiKey; Supplier Part Number: YAG2365CT-ND; Manufacturer Part Number: RC0201JR-0782RL; RoHS: Compliant; Category: Chip SMD Resistors; Stock: 21905; Pricing: 1=0,1, 10=0,028, 25=0,0204, 50=0,0166, 100=0,0135, 250=0,01048, 500=0,00878, 1000=0,00744, 5000=0,00534 (USD); Case/Package: 0201; Case Code (Imperial): 0201; Case Code (Metric): 0603; China RoHS: Non-Compliant; Composition: Thick Film; Contact Plating: Tin; Features: Moisture Resistant; Height: 230µm; Lead Free: Lead Free; Length: 600µm; Lifecycle Status: Production; Max Operating Temperature: 125°C; Min Operating Temperature: -55°C; Mounting Technology: Surface Mount; Number of Terminals: 2; Number of Terminations: 2; Power Rating: 50mW; Radiation Hardening: No; REACH SVHC: Yes; Termination: SMD/SMT; Tolerance: 5%; Width: 300µm; Working Voltage: 25V; ComponentLink1URL: https://datasheet.octopart.com:443/RC0201JR-0782RL-Yageo-datasheet-175887523.pdf?src-supplier=IHS; ComponentLink1Description: https://datasheet.octopart.com:443/RC0201JR-0782RL-Yageo-datasheet-175887523.pdf?src-supplier=IHS; ComponentLink2URL: https://datasheet.octopart.com:443/RC0201JR-0782RL-Yageo-Group-datasheet-176638170.pdf?src-supplier=Future+Electronics; ComponentLink2Description: https://datasheet.octopart.com:443/RC0201JR-0782RL-Yageo-Group-datasheet-176638170.pdf?src-supplier=Future+Electronics; ComponentLink3URL: https://datasheet.octopart.com:443/RC0201JR-0782RL-Yageo-datasheet-164759695.pdf?src-supplier=Future+Electronics; ComponentLink3Description: https://datasheet.octopart.com:443/RC0201JR-0782RL-Yageo-datasheet-164759695.pdf?src-supplier=Future+Electronics; ComponentLink4URL: https://datasheet.octopart.com:443/RC0201JR-0782RL-Yageo-datasheet-127823281.pdf?src-supplier=Future+Electronics; ComponentLink4Description: https://datasheet.octopart.com:443/RC0201JR-0782RL-Yageo-datasheet-127823281.pdf?src-supplier=Future+Electronics; ComponentLink5URL: https://datasheet.octopart.com:443/RC0201JR-0782RL-Yageo-datasheet-137700087.pdf?src-supplier=Future+Electronics; ComponentLink5Description: https://datasheet.octopart.com:443/RC0201JR-0782RL-Yageo-datasheet-137700087.pdf?src-supplier=Future+Electronics; ComponentLink6URL: https://datasheet.octopart.com:443/RC0201JR-0782RL-Yageo-datasheet-103092701.pdf?src-supplier=Future+Electronics; ComponentLink6Description: https://datasheet.octopart.com:443/RC0201JR-0782RL-Yageo-datasheet-103092701.pdf?src-supplier=Future+Electronics; ComponentLink7URL: https://datasheet.octopart.com:443/RC0201JR-0782RL-Yageo-datasheet-98239111.pdf?src-supplier=Future+Electronics; ComponentLink7Description: https://datasheet.octopart.com:443/RC0201JR-0782RL-Yageo-datasheet-98239111.pdf?src-supplier=Future+Electronics; ComponentLink8URL: https://datasheet.octopart.com:443/RC0201JR-0782RL-Yageo-datasheet-37140709.pdf?src-supplier=Future+Electronics; ComponentLink8Description: https://datasheet.octopart.com:443/RC0201JR-0782RL-Yageo-datasheet-37140709.pdf?src-supplier=Future+Electronics; ComponentLink9URL: https://datasheet.octopart.com:443/RC0201JR-0782RL-Yageo-datasheet-12590898.pdf?src-supplier=Future+Electronics; ComponentLink9Description: https://datasheet.octopart.com:443/RC0201JR-0782RL-Yageo-datasheet-12590898.pdf?src-supplier=Future+Electronics; ComponentLink10URL: https://datasheet.octopart.com:443/RC0201JR-0782RL-Yageo-datasheet-12509713.pdf?src-supplier=Future+Electronics; ComponentLink10Description: https://datasheet.octopart.com:443/RC0201JR-0782RL-Yageo-datasheet-12509713.pdf?src-supplier=Future+Electronics; ComponentLink11URL: https://datasheet.octopart.com:443/RC0201JR-0782RL-Yageo-datasheet-8325180.pdf?src-supplier=Future+Electronics; ComponentLink11Description: https://datasheet.octopart.com:443/RC0201JR-0782RL-Yageo-datasheet-8325180.pdf?src-supplier=Future+Electronics; ComponentLink12URL: https://datasheet.octopart.com:443/RC0201JR-0782RL-Yageo-datasheet-12535854.pdf?src-supplier=Future+Electronics; ComponentLink12Description: https://datasheet.octopart.com:443/RC0201JR-0782RL-Yageo-datasheet-12535854.pdf?src-supplier=Future+Electronics; ComponentLink13URL: https://datasheet.octopart.com/RC0201JR-0782RL-Yageo-datasheet-73766026.pdf; ComponentLink13Description: https://datasheet.octopart.com/RC0201JR-0782RL-Yageo-datasheet-73766026.pdf; ComponentLink14URL: http://sigma.octopart.com:80/conflict_mineral_statement/Yageo-company-3.pdf?src-supplier=Compliance+Statements; ComponentLink14Description: http://sigma.octopart.com:80/conflict_mineral_statement/Yageo-company-3.pdf?src-supplier=Compliance+Statements; ComponentLink15URL: http://sigma.octopart.com:80/rohs_statement/Yageo-company-2.pdf?src-supplier=Compliance+Statements; ComponentLink15Description: http://sigma.octopart.com:80/rohs_statement/Yageo-company-2.pdf?src-supplier=Compliance+Statements; Supplier 1: DigiKey; Supplier Part Number 1: YAG2365CT-ND